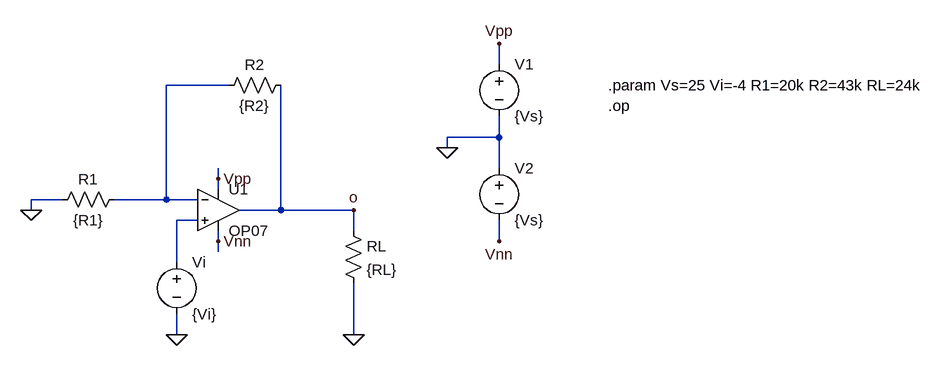
[diagram p0: schematic Q2.asc]
Q2.asc, the LTspice schematic file:
Version 4.1
SHEET 1 1276 680
WIRE 576 -48 576 -80
WIRE 160 -16 64 -16
WIRE 576 64 576 32
WIRE 576 64 496 64
WIRE 496 80 496 64
WIRE 576 112 576 64
WIRE 144 128 144 112
WIRE 144 144 144 128
WIRE -96 160 -144 160
WIRE 64 160 64 -16
WIRE 64 160 -16 160
WIRE 112 160 64 160
WIRE -144 176 -144 160
WIRE 240 176 240 -16
WIRE 240 176 176 176
WIRE 352 176 240 176
WIRE 112 192 80 192
WIRE 352 208 352 176
WIRE 144 224 144 208
WIRE 576 224 576 192
WIRE 144 240 144 224
WIRE 80 256 80 192
WIRE 80 368 80 336
WIRE 352 368 352 288
FLAG 144 128 Vpp
FLAG 144 224 Vnn
FLAG -144 176 0
FLAG 80 368 0
FLAG 352 368 0
FLAG 496 80 0
FLAG 576 -80 Vpp
FLAG 576 224 Vnn
FLAG 352 176 o
SYMBOL OpAmps\\OP07 144 112 R0
SYMATTR InstName U1
SYMBOL res 0 144 R90
WINDOW 0 0 56 VBottom 2
WINDOW 3 32 56 VTop 2
SYMATTR InstName R1
SYMATTR Value {R1}
SYMBOL voltage 80 240 R0
SYMATTR InstName Vi
SYMATTR Value {Vi}
SYMBOL res 256 -32 R90
WINDOW 0 0 56 VBottom 2
WINDOW 3 32 56 VTop 2
SYMATTR InstName R2
SYMATTR Value {R2}
SYMBOL res 336 192 R0
SYMATTR InstName RL
SYMATTR Value {RL}
SYMBOL voltage 576 -64 R0
SYMATTR InstName V1
SYMATTR Value {Vs}
SYMBOL voltage 576 96 R0
SYMATTR InstName V2
SYMATTR Value {Vs}
TEXT 744 -16 Left 2 !.param Vs=25 Vi=-4 R1=20k R2=43k RL=24k\n.op

The netlist it stands for:
* Q2.asc
X§U1 N002 N001 Vpp Vnn o LT1001  ; OP07, pins In+ In- V+ V- OUT
R1 N001 0 {R1}
Vi N002 0 {Vi}
R2 o N001 {R2}
RL o 0 {RL}
V1 Vpp 0 {Vs}
V2 0 Vnn {Vs}
.param Vs=25 Vi=-4 R1=20k R2=43k RL=24k
.op
.lib LTC.lib
.backanno
.end